# Altium schematic sheet STM32 MCU.SchDoc
size A4; Organization: TESLA Motors, INC; Address1: 3500 Deer Creek Road; Address2: Palo Alto, CA; Address4: U.S.A.; SheetNumber: 2; SheetTotal: 21
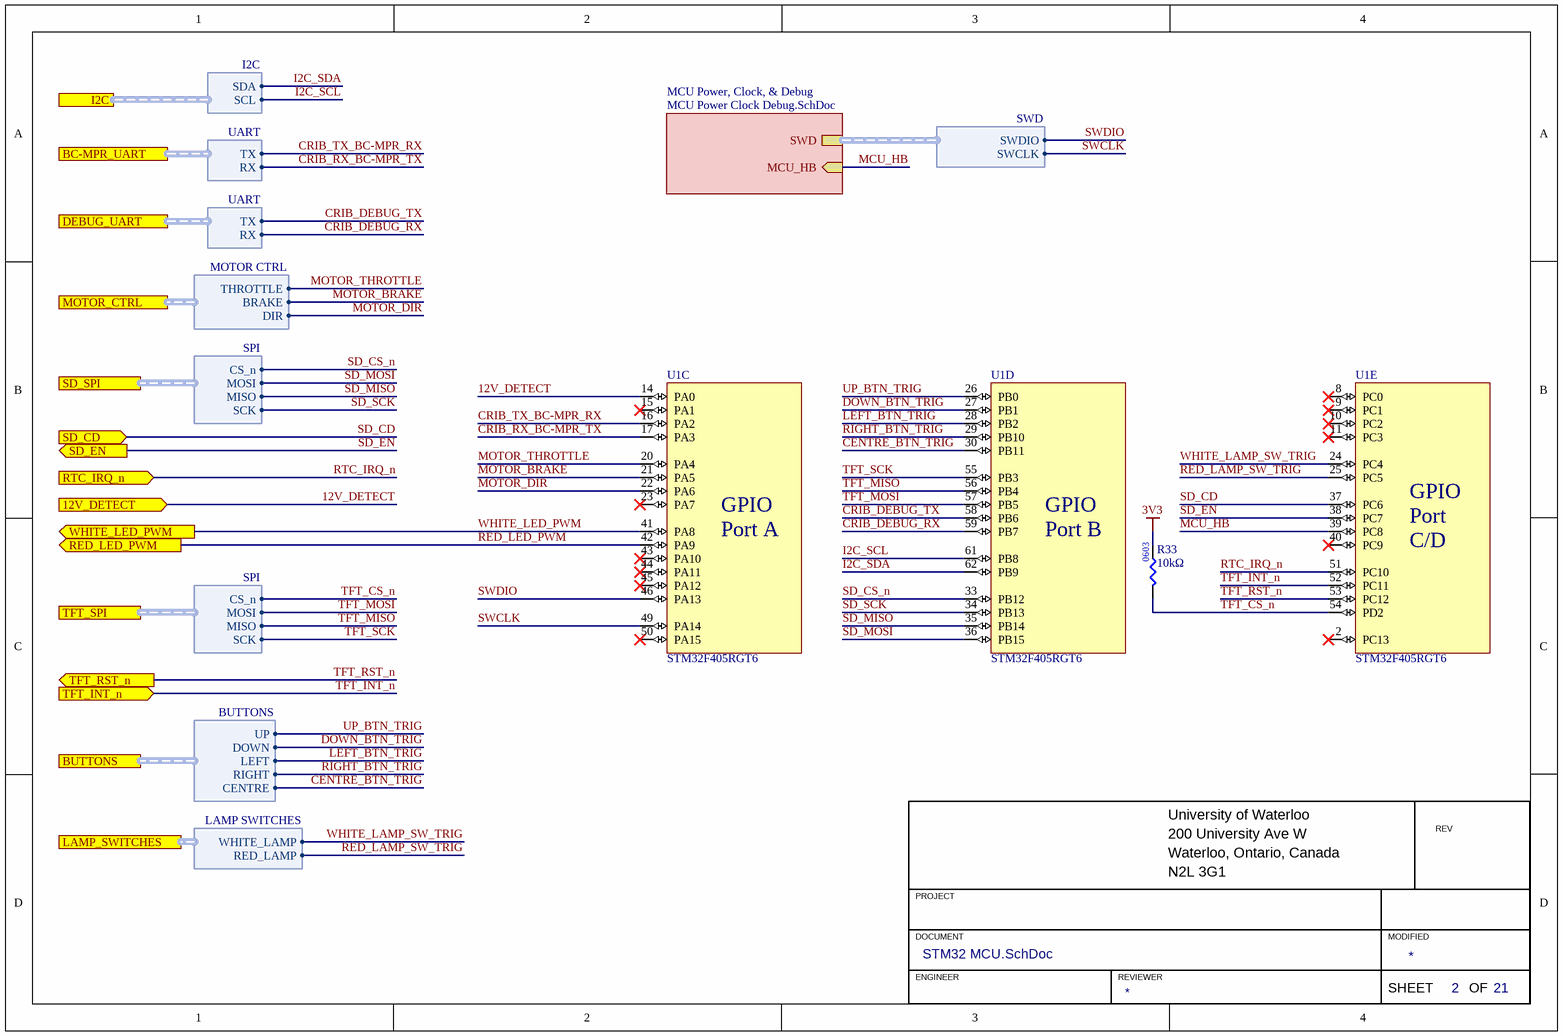
[diagram p0: STM32 MCU.SchDoc]

## Parts
R33  value 10kΩ  [RES0603]  (hidden comment: RES_10kΩ_0603_1%)
U1  STM32F405RGT6  [STM_LQFP64]  (parts C,D,E of 5)

## Sub-sheets
MCU Power, Clock, & Debug = MCU Power Clock Debug.SchDoc: SWD (harness SWD), MCU_HB (in)

## Ports
12V_DETECT (in), BC-MPR_UART (harness UART), BUTTONS (harness BUTTONS), DEBUG_UART (harness UART), I2C (harness I2C), LAMP_SWITCHES (harness LAMP SWITCHES), MOTOR_CTRL (harness MOTOR CTRL), RED_LED_PWM (out), RTC_IRQ_n (in), SD_CD (in), SD_EN (out), SD_SPI (harness SPI), TFT_INT_n (in), TFT_RST_n (out), TFT_SPI (harness SPI), WHITE_LED_PWM (out)

## Harnesses
SWD: SWDIO, SWCLK
I2C: SDA, SCL
UART: TX, RX
MOTOR CTRL: THROTTLE, BRAKE, DIR
SPI: CS_n, MOSI, MISO, SCK
BUTTONS: UP, DOWN, LEFT, RIGHT, CENTRE
LAMP SWITCHES: WHITE_LAMP, RED_LAMP

## Nets
3V3: R33.2
12V_DETECT: U1.14(PA0) ; port 12V_DETECT
CENTRE_BTN_TRIG: U1.30(PB11) ; port BUTTONS.CENTRE
CRIB_DEBUG_RX: U1.59(PB7) ; port DEBUG_UART.RX
CRIB_DEBUG_TX: U1.58(PB6) ; port DEBUG_UART.TX
CRIB_RX_BC-MPR_TX: U1.17(PA3) ; port BC-MPR_UART.RX
CRIB_TX_BC-MPR_RX: U1.16(PA2) ; port BC-MPR_UART.TX
DOWN_BTN_TRIG: U1.27(PB1) ; port BUTTONS.DOWN
I2C_SCL: U1.61(PB8) ; port I2C.SCL
I2C_SDA: U1.62(PB9) ; port I2C.SDA
LEFT_BTN_TRIG: U1.28(PB2) ; port BUTTONS.LEFT
MCU_HB: U1.39(PC8) ; sheet MCU Power, Clock, & Debug/MCU_HB
MOTOR_BRAKE: U1.21(PA5) ; port MOTOR_CTRL.BRAKE
MOTOR_DIR: U1.22(PA6) ; port MOTOR_CTRL.DIR
MOTOR_THROTTLE: U1.20(PA4) ; port MOTOR_CTRL.THROTTLE
RED_LAMP_SW_TRIG: U1.25(PC5) ; port LAMP_SWITCHES.RED_LAMP
RED_LED_PWM: U1.42(PA9) ; port RED_LED_PWM
RIGHT_BTN_TRIG: U1.29(PB10) ; port BUTTONS.RIGHT
RTC_IRQ_n: U1.51(PC10) ; port RTC_IRQ_n
SD_CD: U1.37(PC6) ; port SD_CD
SD_CS_n: U1.33(PB12) ; port SD_SPI.CS_n
SD_EN: U1.38(PC7) ; port SD_EN
SD_MISO: U1.35(PB14) ; port SD_SPI.MISO
SD_MOSI: U1.36(PB15) ; port SD_SPI.MOSI
SD_SCK: U1.34(PB13) ; port SD_SPI.SCK
SWCLK: U1.49(PA14) ; sheet MCU Power, Clock, & Debug/SWD.SWCLK
SWDIO: U1.46(PA13) ; sheet MCU Power, Clock, & Debug/SWD.SWDIO
TFT_CS_n: R33.1 U1.54(PD2) ; port TFT_SPI.CS_n
TFT_INT_n: U1.52(PC11) ; port TFT_INT_n
TFT_MISO: U1.56(PB4) ; port TFT_SPI.MISO
TFT_MOSI: U1.57(PB5) ; port TFT_SPI.MOSI
TFT_RST_n: U1.53(PC12) ; port TFT_RST_n
TFT_SCK: U1.55(PB3) ; port TFT_SPI.SCK
UP_BTN_TRIG: U1.26(PB0) ; port BUTTONS.UP
WHITE_LAMP_SW_TRIG: U1.24(PC4) ; port LAMP_SWITCHES.WHITE_LAMP
WHITE_LED_PWM: U1.41(PA8) ; port WHITE_LED_PWM

Not connected (* = marked no-connect by the designer): U1 2(PC13)* 8(PC0)* 9(PC1)* 10(PC2)* 11(PC3)* 15(PA1)* 23(PA7)* 40(PC9)* 43(PA10)* 44(PA11)* 45(PA12)* 50(PA15)*

## Notes on the sheet
- University of Waterloo
- 200 University Ave W
- REV
- PROJECT
- Waterloo, Ontario, Canada
- N2L 3G1
- DOCUMENT
- ENGINEER
- REVIEWER
- MODIFIED
- SHEET
- OF
- (in symbol STM32F405RGT6, part C) GPIO / Port A
- (in symbol STM32F405RGT6, part D) GPIO / Port B
- (in symbol STM32F405RGT6, part E) GPIO / Port C/D

## Library data of the parts
R33 = RES_10kΩ_0603_1%: RES 10K OHM 1% 1/8W 0603; Manufacturer 1: Stackpole Electronics Inc; Manufacturer Part Number 1: RNCP0603FTD10K0; Supplier Part Number 1: RNCP0603FTD10K0CT-ND; Supplier 1: Digi-Key; Mounting Type: SMD; Package: 0603
U1 = STM32F405RGT6: IC MCU 32BIT 1MB FLASH 64LQFP; Manufacturer 1: STMicroelectronics; Package/Footprint: 64-LQFP; Manufacturer Part Number 1: STM32F405RGT6; Supplier 1: Digi-Key; Supplier Part Number 1: 497-11767-ND